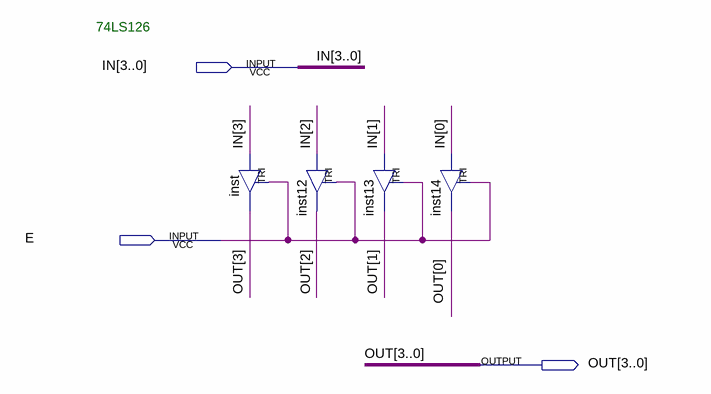
[diagram p0: schematic sheet]
// Quartus schematic 74LS126_TriState_Buffer.bdf as structural Verilog: 4 symbols, 3 pins
module \74LS126_TriState_Buffer  (
  input  [3:0] IN,
  input  E,
  output [3:0] OUT
);

  TRI inst (.IN(IN[3]), .OE(E), .OUT(OUT[3]));
  TRI inst12 (.IN(IN[2]), .OE(E), .OUT(OUT[2]));
  TRI inst13 (.IN(IN[1]), .OE(E), .OUT(OUT[1]));
  TRI inst14 (.IN(IN[0]), .OE(E), .OUT(OUT[0]));

  // Notes on the sheet:
  //   74LS126
endmodule
